# Altium project Key_Project.PrjPcb
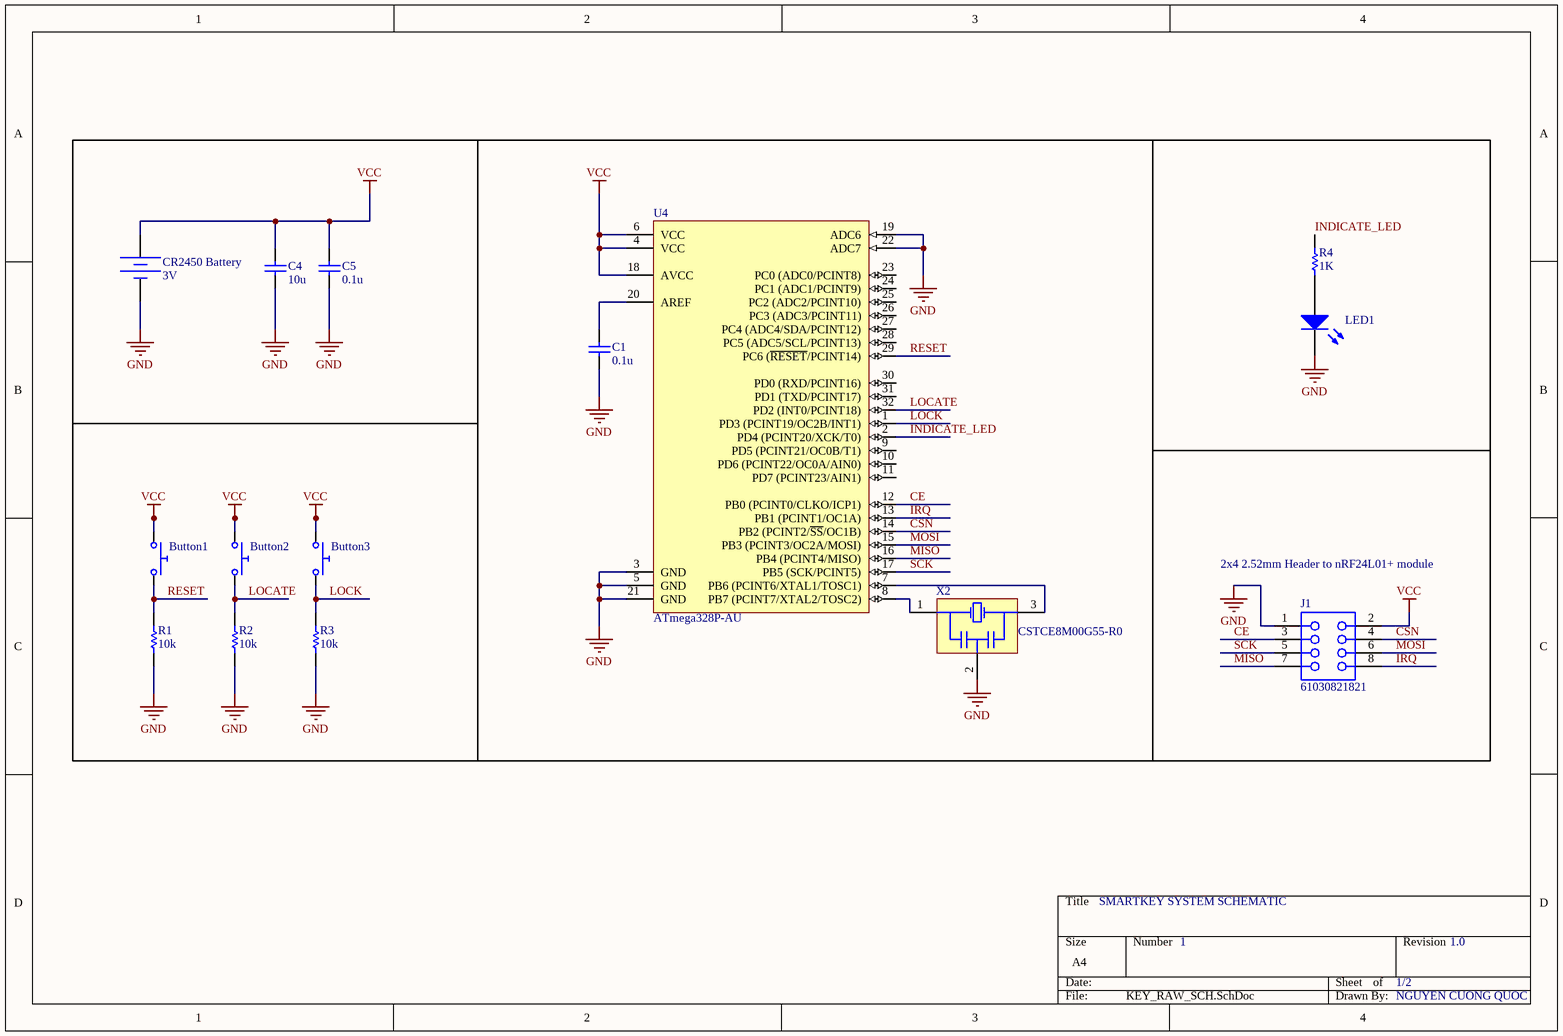
[diagram p0: KEY_RAW_SCH.SchDoc]
3 sheets, 65 parts. Net scope: global (net labels, ports and power ports of the same name join across sheets).
Sheets:
  KEY_RAW_SCH.SchDoc
  VEHICLE_RAW_SCH.SchDoc
  KEY_PCB.SchDoc

## Sheet KEY_RAW_SCH.SchDoc
size A4; SheetNumber: 1; SheetTotal: 3

### Parts
Button1  Push Button Normally Opened  (value not drawn)
Button2  Push Button Normally Opened  (value not drawn)
Button3  Push Button Normally Opened  (value not drawn)
C1  value 0.1u  (hidden comment: Capacitor)
C4  value 10u  (hidden comment: Capacitor)
C5  value 0.1u  (hidden comment: Capacitor)
CR2450_Battery  DC Magnitude: 3V  (hidden comment: Constant Voltage Source)
J1  61030821821  [61030821821]
LED1  Light-Emitting Diode  (value not drawn)
R1  value 10k  (hidden comment: Resistor)
R2  value 10k  (hidden comment: Resistor)
R3  value 10k  (hidden comment: Resistor)
R4  value 1K  (hidden comment: Resistor)
U4  ATmega328P-AU  [32A_M]
X2  CSTCE8M00G55-R0  [MURA-CSTCE_G_A-3_V]

### Nets
GND: C1.1 C4.1 C5.1 CR2450_Battery.2 J1.1 LED1.2(K) R1.1 R2.1 R3.1 U4.3(GND) U4.5(GND) U4.19(ADC6) U4.21(GND) U4.22(ADC7) X2.2(GND)
VCC: Button1.1 Button2.1 Button3.1 C4.2 C5.2 CR2450_Battery.1 J1.2 U4.4(VCC) U4.6(VCC) U4.18(AVCC)
CE: J1.3 U4.12(PB0_(PCINT0/CLKO/ICP1))
CSN: J1.4 U4.14(PB2_(PCINT2/~{SS}/OC1B))
INDICATE_LED: R4.2 U4.2(PD4_(PCINT20/XCK/T0))
IRQ: J1.8 U4.13(PB1_(PCINT1/OC1A))
LOCATE: Button2.2 R2.2 U4.32(PD2_(INT0/PCINT18))
LOCK: Button3.2 R3.2 U4.1(PD3_(PCINT19/OC2B/INT1))
MISO: J1.7 U4.16(PB4_(PCINT4/MISO))
MOSI: J1.6 U4.15(PB3_(PCINT3/OC2A/MOSI))
RESET: Button1.2 R1.2 U4.29(PC6_(~{RESET}/PCINT14))
SCK: J1.5 U4.17(PB5_(SCK/PCINT5))
NetC1_2: C1.2 U4.20(AREF)
NetLED1_1: LED1.1(A) R4.1
NetU4_7: U4.7(PB6_(PCINT6/XTAL1/TOSC1)) X2.3(X2)
NetU4_8: U4.8(PB7_(PCINT7/XTAL2/TOSC2)) X2.1(X1)

Not connected (* = marked no-connect by the designer): U4 9(PD5_(PCINT21/OC0B/T1)) 10(PD6_(PCINT22/OC0A/AIN0)) 11(PD7_(PCINT23/AIN1)) 23(PC0_(ADC0/PCINT8)) 24(PC1_(ADC1/PCINT9)) 25(PC2_(ADC2/PCINT10)) 26(PC3_(ADC3/PCINT11)) 27(PC4_(ADC4/SDA/PCINT12)) 28(PC5_(ADC5/SCL/PCINT13)) 30(PD0_(RXD/PCINT16)) 31(PD1_(TXD/PCINT17))

### Notes on the sheet
- 2x4 2.52mm Header to nRF24L01+ module
- SMARTKEY SYSTEM SCHEMATIC
- 1
- 1/2
- 1.0
- NGUYEN CUONG QUOC

### Library data of the parts
Button1-Button3 = Push Button NO: closed: 0; Rclosed: 1m; Ropen: 1Meg; SimulationGenericComponent: True
C1 C4 C5 = Capacitor: SimulationGenericComponent: True
CR2450_Battery = Battery: SimulationGenericComponent: True
J1 = CMP-1502-01304-3: NexarPartId: 89205501; Gender: Female; Current Rating: 3A; Operating Supply Voltage: 250V; Contact Resistance: 20mΩ; Orientation: Vertical; RoHS: Non-Compliant; Number of Pins: 8; Packaging: Tape and Reel; Lead Pitch: 2.54mm
LED1 = LED: AF: 1; BV: 0; BV_MAX: 1e99; EG: 1.11; FC: 0.5; IBV: 0.001; IS: 1e-14; MJSW: 0.33; NTUN: 30; TNOM: 27; XTI: 3; SimulationGenericComponent: True; CJO: 0; CJP: 0; CTA: 0; CTP: 0; FCS: 0.5; FV_MAX: 1e99; IKF: 0; IKR: 0; ISR: 1e-14; JSW: 0; JTUN: 0; JTUNSW: 0; KEG: 1; KF: 0; LEVEL: 1; N: 1; NBV: 1; NR: 1; NS: 1; PHP: 1; RS: 0; TCV: 0; TLEV: 0; TLEVC: 0; TM1: 0; TM2: 0; TPB: 0; TPHP: 0; TRS: 0; TRS2: 0; TT: 0; TTT1: 0; TTT2: 0; VJ: 1; XTITUN: 3
R1-R4 = Resistor: TC1: 0; SimulationGenericComponent: True; TC2: 0
U4 = CMP-0095-00269-2: 8-bit AVR Microcontroller, 32KB Flash, 1KB EEPROM, 2KB SRAM, 32-pin TQFP, Industrial Grade (-40°C to 85°C); PackageDescription: 32-Lead, 7x7x1.0 mm Body, 0.8mm Lead Pitch, Thin Profile Plastic Quad Flat Package (TQFP); DatasheetVersion: revD, May-2011; RevisionNote: DatasheetVersion & PackageVersion updated. URLs added.; ComponentLink1URL: http://www.atmel.com/; ComponentLink2Description: ATmega48A/48PA/88A/88PA/168A/168PA/328/328P Datasheet; Code_JEDEC: MS-026-ABA; ComponentLink1Description: Manufacturer URL; PackageReference: 32A; ComponentLink3Description: ATmega48A/48PA/88A/88PA/168A/168PA/328/328P Summary; ComponentLink2URL: http://www.atmel.com/dyn/resources/prod_documents/doc8271.pdf; PackageVersion: revC, Oct-2010; ComponentLink3URL: http://www.atmel.com/dyn/resources/prod_documents/8271S.pdf
X2 = CMP-2100-03620-1: Ceramic Resonator, 8 MHz, +/- 0.5%, -20 to 80 degC, 3-Pin SMD, RoHS, Tape and Reel; Manufacturer: Murata; Capacitance: 33pF; Frequency Stability: 0.2%; Self Resonant Frequency: 8MHz; Datasheet Version: 42339.0; RoHSCompliant: True; Datasheet URL: http://www.murata.com/~/media/webrenewal/support/library/catalog/products/timingdevice/ceralock/p16e.ashx; Case/Package: Ceramic; Load Capacitance: 33pF; Tolerance: 0.5%; Mount: SurfaceMount; Height: 0.031inch; Number of Pins: 3; Package Description: 3-Pin Surface Mount Device, Body 3.2 x 1.3 mm, Pitch 1.2 mm; Package Quantity: 1; Lead Free: LeadFree; Contact Plating: Gold; REACH SVHC: NoSVHC; Length: 0.126inch; Width: 0.051inch; Manufacturer URL: http://www.murata.com/; Packaging: TapeandReel; Termination: SMD/SMT; Frequency Tolerance: 0.5%; Max Operating Temperature: 80degC; Composition: Ceramic; Package Reference: CSTCE_G_A-3; Min Operating Temperature: -20degC; Frequency: 8MHz

## Sheet VEHICLE_RAW_SCH.SchDoc
size A4; SheetNumber: 2; SheetTotal: 3
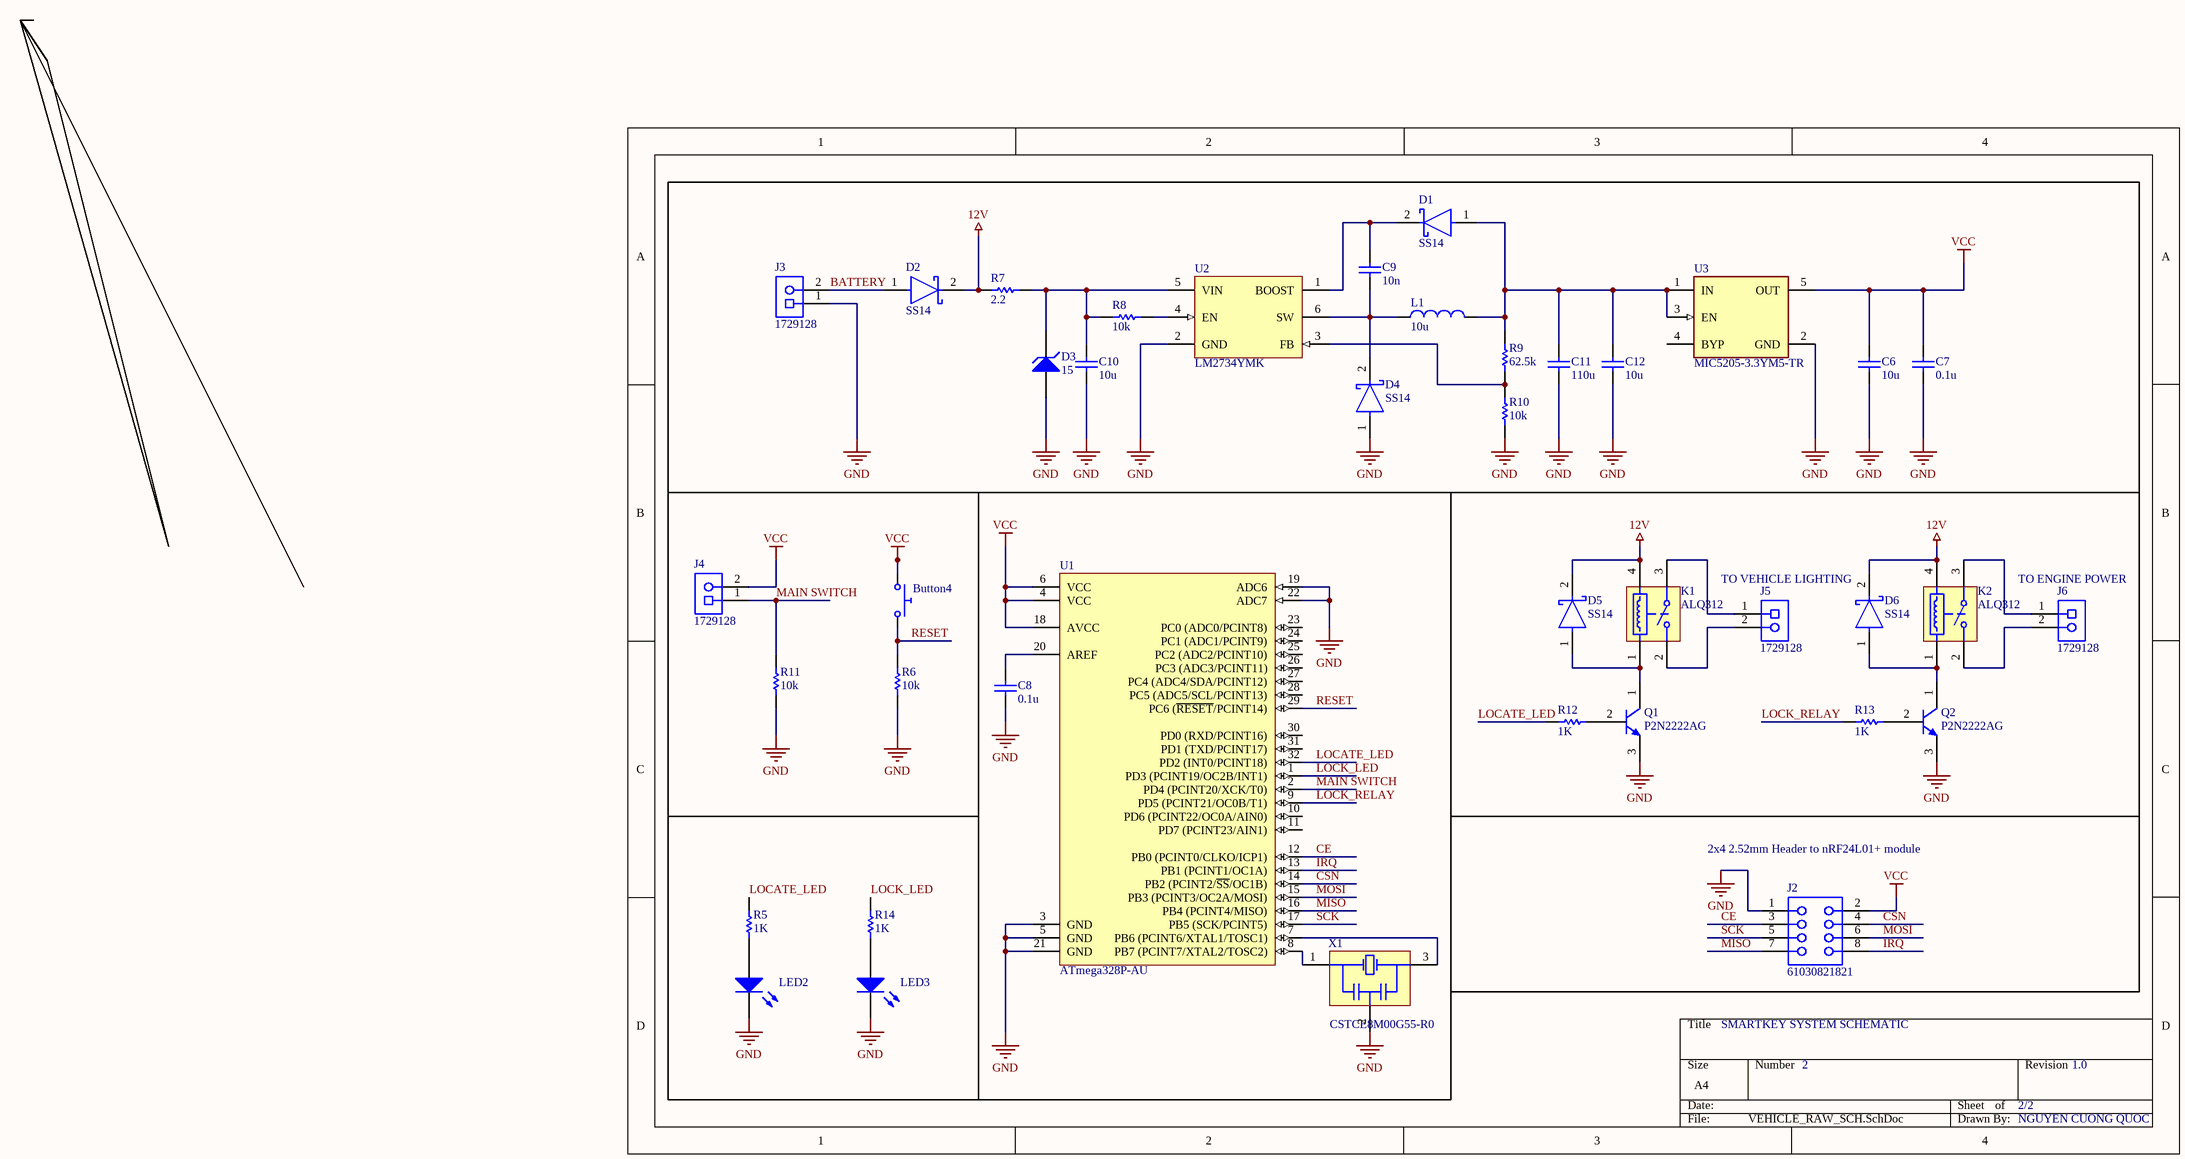
[diagram p1: VEHICLE_RAW_SCH.SchDoc]

### Parts
Button4  Push Button Normally Opened  (value not drawn)
C6  value 10u  (hidden comment: Capacitor)
C7  value 0.1u  (hidden comment: Capacitor)
C8  value 0.1u  (hidden comment: Capacitor)
C9  value 10n  (hidden comment: Capacitor)
C10  value 10u  (hidden comment: Capacitor)
C11  value 110u  (hidden comment: Capacitor)
C12  value 10u  (hidden comment: Capacitor)
D1  SS14  [FP-403AE-MFG]
D2  SS14  [FP-403AE-MFG]
D3  BV: 15  (hidden comment: Zener Diode)
D4  SS14  [FP-403AE-MFG]
D5  SS14  [FP-403AE-MFG]
D6  SS14  [FP-403AE-MFG]
J2  61030821821  [61030821821]
J3  1729128  [PHOE-1729128-2_V]
J4  1729128  [PHOE-1729128-2_V]
J5  1729128  [PHOE-1729128-2_V]
J6  1729128  [PHOE-1729128-2_V]
K1  ALQ312  [PNSC-LQ-4-2000x1000x1600_V]
K2  ALQ312  [PNSC-LQ-4-2000x1000x1600_V]
L1  value 10u  (hidden comment: Inductor)
LED2  Light-Emitting Diode  (value not drawn)
LED3  Light-Emitting Diode  (value not drawn)
Q1  P2N2222AG  [ONSC-TO-92-3-29-11]
Q2  P2N2222AG  [ONSC-TO-92-3-29-11]
R5  value 1K  (hidden comment: Resistor)
R6  value 10k  (hidden comment: Resistor)
R7  value 2.2  (hidden comment: Resistor)
R8  value 10k  (hidden comment: Resistor)
R9  value 62.5k  (hidden comment: Resistor)
R10  value 10k  (hidden comment: Resistor)
R11  value 10k  (hidden comment: Resistor)
R12  value 1K  (hidden comment: Resistor)
R13  value 1K  (hidden comment: Resistor)
R14  value 1K  (hidden comment: Resistor)
U1  ATmega328P-AU  [32A_M]
U2  LM2734YMK  [DDC0006A_M]
U3  MIC5205-3.3YM5-TR  [FP-M5-MFG]
X1  CSTCE8M00G55-R0  [MURA-CSTCE_G_A-3_V]

### Nets
12V: D2.2(C) D5.2(C) D6.2(C) K1.4 K2.4 R7.2
GND: C6.1 C7.1 C8.1 C10.1 C11.1 C12.1 D3.1(A) D4.1(A) J2.1 J3.1 LED2.2(K) LED3.2(K) Q1.3(E) Q2.3(E) R6.1 R10.2 R11.1 U1.3(GND) U1.5(GND) U1.19(ADC6) U1.21(GND) U1.22(ADC7) U2.2(GND) U3.2(GND) X1.2(GND)
VCC: Button4.1 C6.2 C7.2 J2.2 J4.2 U1.4(VCC) U1.6(VCC) U1.18(AVCC) U3.5(OUT)
BATTERY: D2.1(A) J3.2
CE: J2.3 U1.12(PB0_(PCINT0/CLKO/ICP1))
CSN: J2.4 U1.14(PB2_(PCINT2/~{SS}/OC1B))
IRQ: J2.8 U1.13(PB1_(PCINT1/OC1A))
LOCATE_LED: R5.2 R12.2 U1.32(PD2_(INT0/PCINT18))
LOCK_LED: R14.2 U1.1(PD3_(PCINT19/OC2B/INT1))
LOCK_RELAY: R13.2 U1.9(PD5_(PCINT21/OC0B/T1))
MAIN SWITCH: J4.1 R11.2 U1.2(PD4_(PCINT20/XCK/T0))
MISO: J2.7 U1.16(PB4_(PCINT4/MISO))
MOSI: J2.6 U1.15(PB3_(PCINT3/OC2A/MOSI))
RESET: Button4.2 R6.2 U1.29(PC6_(~{RESET}/PCINT14))
SCK: J2.5 U1.17(PB5_(SCK/PCINT5))
NetC8_2: C8.2 U1.20(AREF)
NetC9_1: C9.1 D4.2(C) L1.1 U2.6(SW)
NetC9_2: C9.2 D1.2(C) U2.1(BOOST)
NetC10_2: C10.2 D3.2(K) R7.1 R8.2 U2.5(VIN)
NetC11_2: C11.2 C12.2 D1.1(A) L1.2 R9.1 U3.1(IN) U3.3(EN)
NetD5_1: D5.1(A) K1.1 Q1.1(C)
NetD6_1: D6.1(A) K2.1 Q2.1(C)
NetJ5_1: J5.1 K1.3(COM)
NetJ5_2: J5.2 K1.2(NO)
NetJ6_1: J6.1 K2.3(COM)
NetJ6_2: J6.2 K2.2(NO)
NetLED2_1: LED2.1(A) R5.1
NetLED3_1: LED3.1(A) R14.1
NetQ1_2: Q1.2(B) R12.1
NetQ2_2: Q2.2(B) R13.1
NetR8_1: R8.1 U2.4(EN)
NetR9_2: R9.2 R10.1 U2.3(FB)
NetU1_7: U1.7(PB6_(PCINT6/XTAL1/TOSC1)) X1.3(X2)
NetU1_8: U1.8(PB7_(PCINT7/XTAL2/TOSC2)) X1.1(X1)

Not connected (* = marked no-connect by the designer): U1 10(PD6_(PCINT22/OC0A/AIN0)) 11(PD7_(PCINT23/AIN1)) 23(PC0_(ADC0/PCINT8)) 24(PC1_(ADC1/PCINT9)) 25(PC2_(ADC2/PCINT10)) 26(PC3_(ADC3/PCINT11)) 27(PC4_(ADC4/SDA/PCINT12)) 28(PC5_(ADC5/SCL/PCINT13)) 30(PD0_(RXD/PCINT16)) 31(PD1_(TXD/PCINT17)); U3 4(BYP)

### Notes on the sheet
- TO VEHICLE LIGHTING
- (near J6) TO ENGINE POWER
- 2x4 2.52mm Header to nRF24L01+ module
- SMARTKEY SYSTEM SCHEMATIC
- 2
- 2/2
- 1.0
- NGUYEN CUONG QUOC

### Library data of the parts
Button4 = Push Button NO: as Button1 on sheet KEY_RAW_SCH
C6-C12 = Capacitor: SimulationGenericComponent: True
D1 D2 D4-D6 = CMP-2000-04943-2: DIODE SCHOTTKY 40V 1A SMA; Manufacturer: ON Semiconductor; Peak Reverse Current: 0.2mA; Max Junction Temp: +125°C; Standoff Height: 0.05mm; Max Surge Forward Current: 40A; Mouser Description: Schottky Diodes & Rectifiers SMA 40V 1.0A; RoHS: TRUE; Lead Free: Yes; Manufacturer Part Number: SS14; Device Class L3: Schottky Diodes; Category: Diode; Automotive: No; Digikey Description: DIODE SCHOTTKY 40V 1A SMA; ComponentLink2Description: Datasheet; Device Class L2: Diodes; Height: 2.5mm; Temperature Range High: +125°C; ComponentLink2URL: https://www.onsemi.com/pub/Collateral/SS19-D.PDF; Device Class L1: Discrete Semiconductors; Package: 403AE; Octopart: https://octopart.com/ss14-on+semiconductor-29205033; Max Repetitive Reverse Voltage: 40V; Temperature Range Low: -65°C; Forward Current: 1A; Temperature: -65°C to +125°C
D3 = Zener Diode: AF: 1; BV_MAX: 1e99; CJO: 0; EG: 1.11; FC: 0.5; IBV: 0.001; IS: 1e-14; MJSW: 0.33; NTUN: 30; TNOM: 27; XTI: 3; SimulationGenericComponent: True; CJP: 0; CTA: 0; CTP: 0; FCS: 0.5; FV_MAX: 1e99; IKF: 0; IKR: 0; ISR: 1e-14; JSW: 0; JTUN: 0; JTUNSW: 0; KEG: 1; KF: 0; LEVEL: 1; N: 1; NBV: 1; NR: 1; NS: 1; PHP: 1; RS: 0; TCV: 0; TLEV: 0; TLEVC: 0; TM1: 0; TM2: 0; TPB: 0; TPHP: 0; TRS: 0; TRS2: 0; TT: 0; TTT1: 0; TTT2: 0; VJ: 1; XTITUN: 3
J2 = CMP-1502-01304-3: as J1 on sheet KEY_RAW_SCH; Orientation: Vertical; RoHS: Non-Compliant; Number of Pins: 8; Packaging: Tape and Reel; Lead Pitch: 2.54mm
J3-J6 = CMP-2000-05815-1: PCB Terminal Block, 13.5 A, 400 V, 2-Pin THD, RoHS, Bulk; Manufacturer: Phoenix Contact; Package Version: 03/2015; No. of Rows: 1; Pitch: 5.08mm; No. of Positions: 2; Voltage Rating: 400V; Current Rating: 13500mA; Manufacturer URL: http://www.phoenixcontact.com/; Datasheet URL: https://datasheet.ciiva.com/16046/1729128-16046181.pdf; RoHS: TRUE; Package URL: https://www.phoenixcontact.com/online/portal/pi/pxc/product_detail_page/!ut/p/b1/3VdJjqNKFDxLH8AFycySyWY2ozFsEPOMMQaDOX1XedGL_1Vdm5YXJleknhSKeBkvI6EA8ncAo3AYoDhBQGco6KN7VURTdemj9us_IEKEZo_YHiPAEWEFmDGOHMORkqKYCORBZxgL7ZoaZYcbFFUZ3fqxSY6GOuxydWUuHqz1ynmMFygu583Bob0Ewr6Sd_l-5m-kAueHiB0jpRwZwe58wwtkpxtMYd_LmGcDRU02dRNEyWt6Y2ti5pSyJ_reIkzIulrqApdnbT11V5jnCKbYNCvhEM1MCpPByat_X379-iThf08CI5GfOPqfBeS3BRoBOdD55AKVv0iLwCMq-2BrzXWSGRH7pUGD9uwXQjiph3xL0DKQwdGa0JImiIOmBNOestqgwTHSSs2oOep-78apyXQBvNi8ZLaFjvjWvcaUEBu0MC6Wbe-d6mB0FAebo2lUWinqYaZs5DAYzV0RP9yitUjnGJ0iI9xhZkT42OCQNUJJhkgWINNQLP2JFP6OpMg3JCVg70jqHT0lvKOnhHf0lPuOnnLf0VPuWx6_dxwUIvwk5WMkT0kLL1mh61l2yZVSzG3pYV_bqo-mj6uMKwKwdnnW8Jh5RTOJzMOA5c-eJDaZQw4mTMPH02PvS_ZAqNVjVTo2WyYLkwH_KU1mmmG5kjRhDqPXLwwVHvVOjCM60-fpXvTDfMGW1PVFVS1r4e4yVDk4ZdNbkUHvqPqQSeian4UD39fNKmachqdJ1NJbyk8rXT9mXTvPk3oE5meulKGgiruPJek-4I9hTT6G8ZLOyRSm2RRVbThERQad5OS28hdt4YW4vG0stgYYzsWsK4_7y6DZMjJSCqri1kyiZR5vD7pwIrNR7QwPHTcLTI5qT7eRlpHrdGiupYlqQDJ7zy_CND8fWWBoLRXxk1RVcXiBQwbTD4Xi7KL-FuO94t9xaqweXzH; PartNumber: 1729128; Package Description: 2-Pin Through Hole Device, Body 8.1 x 10.16 mm, Pitch 5.08 mm; Datasheet Version: 12/2013; Mounting Technology: ThroughHole; Orientation: Horizontal; Package Reference: 1729128-2; Packing: Bulk
K1 K2 = CMP-1503-00190-1: LQ Relays, 12 V Coil Voltage, 200 mW Nominal Operating Power, -40 to 85 degC, 4-Pin LQ, Carton, Case, RoHS; Manufacturer: Panasonic; Pb-Free: True; Nominal Operating Power: 200 mW; Max Switching Current: 10 A (N.O.), 3 A (N.C.); Electrical Life: 5x10^4; Coil Voltage: 12 V; Mechanical Life(Min.operation): 1x10^7; Max Switching Voltage: 250 V AC; Mounting Technology: Through Hole; ComponentLink3URL: http://www3.panasonic.biz/ac/e_download/control/relay/power/catalog/mech_eng_lq.pdf?f_cd=401220; Series: LQ Relays; Packing: Carton, Case; RoHS: True; PackageVersion: ASCTB92E, 10/2014; ComponentLink1URL: http://www3.panasonic.biz/ac/ae/index.jsp; PartNumber: ALQ312; PackageReference: LQ-4-2000x1000x1600; PackageDescription: 4-Pin Through Hole Terminal Package, Body 20 x 10 mm; ComponentLink2URL: http://www3.panasonic.biz/ac/e_download/control/relay/power/catalog/mech_eng_lq.pdf?f_cd=401220; ComponentLink3Description: Package Specification; ComponentLink2Description: Datasheet; ComponentLink1Description: Manufacturer URL; DatasheetVersion: 201410-T
L1 = Inductor: SimulationGenericComponent: True
LED2 LED3 = LED: as LED1 on sheet KEY_RAW_SCH; CJO: 0; CJP: 0; CTA: 0; CTP: 0; FCS: 0.5; FV_MAX: 1e99; IKF: 0; IKR: 0; ISR: 1e-14; JSW: 0; JTUN: 0; JTUNSW: 0; KEG: 1; KF: 0; LEVEL: 1; N: 1; NBV: 1; NR: 1; NS: 1; PHP: 1; RS: 0; TCV: 0; TLEV: 0; TLEVC: 0; TM1: 0; TM2: 0; TPB: 0; TPHP: 0; TRS: 0; TRS2: 0; TT: 0; TTT1: 0; TTT2: 0; VJ: 1; XTITUN: 3
Q1 Q2 = CMP-1048-01402-1: Amplifier Transistor, NPN Silicon, 3-Pin TO-92, Pb-Free, Bulk Box; Manufacturer: On Semiconductor; IC Continuous (A): 0.6; fT Min (MHz): 300; ComponentLink2Description: Datasheet; ComponentLink1Description: Manufacturer URL; ComponentLink2URL: http://www.onsemi.com/pub_link/Collateral/P2N2222A-D.PDF; ComponentLink3Description: Package Specification; RoHS: TRUE; ComponentLink1URL: http://www.onsemi.com/; PartNumber: P2N2222AG; Mounting Technology: Through Hole; PackageReference: TO-92-3-29-11_AM_SL; Polarity: NPN; Packing: Bulk Box; DatasheetVersion: Rev. 7; PackageDescription: 3-Pin Transistor Outline, Body 4.825 x 3.685 mm, Pitch 1.27 mm; PackageVersion: Rev. AM; ComponentLink3URL: http://www.onsemi.cn/pub_link/Collateral/2N6426-D.PDF
R5-R14 = Resistor: TC1: 0; SimulationGenericComponent: True; TC2: 0
U1 = CMP-0095-00269-2: as U4 on sheet KEY_RAW_SCH; PackageDescription: 32-Lead, 7x7x1.0 mm Body, 0.8mm Lead Pitch, Thin Profile Plastic Quad Flat Package (TQFP); DatasheetVersion: revD, May-2011; RevisionNote: DatasheetVersion & PackageVersion updated. URLs added.; ComponentLink1URL: http://www.atmel.com/; ComponentLink2Description: ATmega48A/48PA/88A/88PA/168A/168PA/328/328P Datasheet; Code_JEDEC: MS-026-ABA; ComponentLink1Description: Manufacturer URL; PackageReference: 32A; ComponentLink3Description: ATmega48A/48PA/88A/88PA/168A/168PA/328/328P Summary; ComponentLink2URL: http://www.atmel.com/dyn/resources/prod_documents/doc8271.pdf; PackageVersion: revC, Oct-2010; ComponentLink3URL: http://www.atmel.com/dyn/resources/prod_documents/8271S.pdf
U2 = CMP-0069-01204-3: 1A Load Step-Down DC-DC Regulator, 6-pin Tiny SOT23; Manufacturer: Texas Instruments; PackageTopMarking: SFEB*XTT; PowerWise: N; CompType: Switcher; PinCount: 6; Code_JEDEC: MO-193-AA; PackageDescription: Molded TSOT, 2.97 x 1.65 x 0.87mm Body, 6 Lead, 0.95mm Pitch; PackageReference: DDC0006A; Code_IPC: SOT26A-6; RoHS: N; ComponentLink1URL: http://www.ti.com/general/docs/lit/getliterature.tsp?genericPartNumber=LM2734&fileType=pdf; ComponentLink1Description: Datasheet URL
U3 = CMP-06324-000014-1: IC REG LINEAR 3.3V 150MA SOT23-5; Manufacturer: Microchip; Number Of Outputs: 1; Output Type: Fixed; Min Supply Voltage: 2.5V; Accuracy Percentage: 2%; Dropout Voltage: 165mV; Max Supply Voltage: 16V; Max Junction Temp: +125°C; Standoff Height: 0mm; Digikey Description: IC REG LINEAR 3.3V 150MA SOT23-5; Output Current: 150mA; Temperature: -40°C to +125°C; Temperature Range High: +125°C; Height: 1.45mm; ComponentLink2URL: http://ww1.microchip.com/downloads/en/DeviceDoc/20005785A.pdf; Mouser Description: LDO Voltage Regulators; Device Class L3: Voltage Regulators - Linear; Package: M5; Temperature Range Low: -40°C; Device Class L1: Integrated Circuits (ICs); ComponentLink2Description: Datasheet; Automotive: No; Ipc Land Pattern Name: SOT95P280X118-5; Octopart: https://octopart.com/mic5205-3.3ym5-tr-microchip-66802130; Device Class L2: Power Management ICs; Manufacturer Part Number: MIC5205-3.3YM5-TR; Lead Free: Yes; RoHS: TRUE
X1 = CMP-2100-03620-1: as X2 on sheet KEY_RAW_SCH; Datasheet Version: 42339.0; RoHSCompliant: True; Datasheet URL: http://www.murata.com/~/media/webrenewal/support/library/catalog/products/timingdevice/ceralock/p16e.ashx; Case/Package: Ceramic; Load Capacitance: 33pF; Tolerance: 0.5%; Mount: SurfaceMount; Height: 0.031inch; Number of Pins: 3; Package Description: 3-Pin Surface Mount Device, Body 3.2 x 1.3 mm, Pitch 1.2 mm; Package Quantity: 1; Lead Free: LeadFree; Contact Plating: Gold; REACH SVHC: NoSVHC; Length: 0.126inch; Width: 0.051inch; Manufacturer URL: http://www.murata.com/; Packaging: TapeandReel; Termination: SMD/SMT; Frequency Tolerance: 0.5%; Max Operating Temperature: 80degC; Composition: Ceramic; Package Reference: CSTCE_G_A-3; Min Operating Temperature: -20degC; Frequency: 8MHz

## Sheet KEY_PCB.SchDoc
size A4; SheetNumber: 3; SheetTotal: 3
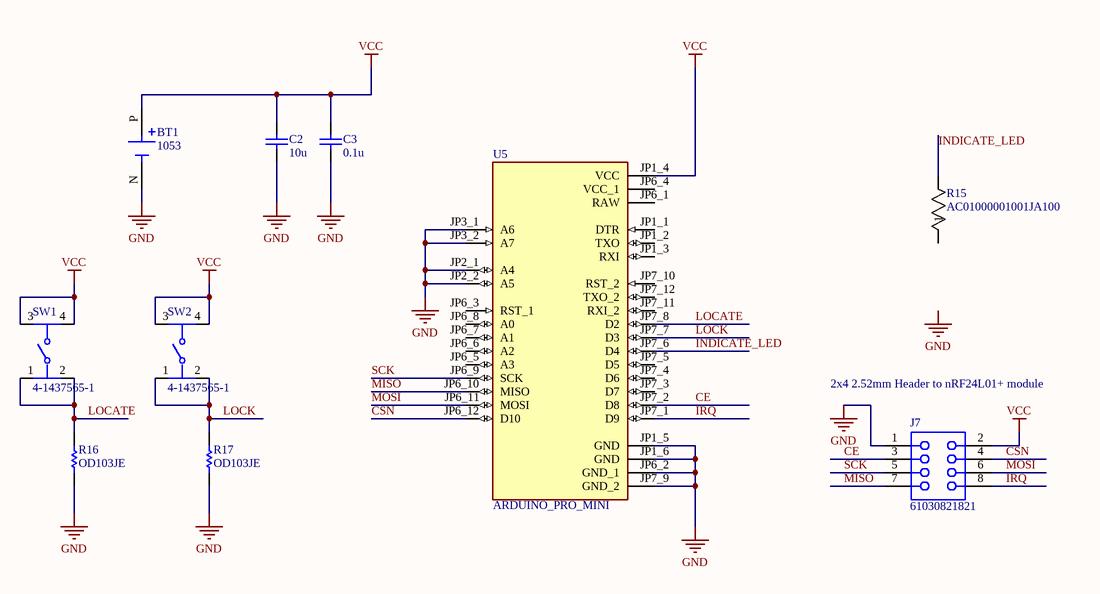
[diagram p2: KEY_PCB.SchDoc]

### Parts
BT1  1053  [BAT_1053]
C2  value 10u  (hidden comment: Capacitor)
C3  value 0.1u  (hidden comment: Capacitor)
J7  61030821821  [61030821821]
R15  AC01000001001JA100  [RES_AC01_VIS]
R16  OD103JE  [OMTE-RES7X2.5-2]
R17  OD103JE  [OMTE-RES7X2.5-2]
SW1  4-1437565-1  [FP-4-1437565-1-MFG]
SW2  4-1437565-1  [FP-4-1437565-1-MFG]
U5  ARDUINO_PRO_MINI  [MODULE_ARDUINO_PRO_MINI]

### Nets
GND: BT1.N(NEG) C2.1 C3.1 J7.1 R16.1 R17.1 U5.JP1_5(GND) U5.JP1_6(GND) U5.JP2_1(A4) U5.JP2_2(A5) U5.JP3_1(A6) U5.JP3_2(A7) U5.JP6_2(GND_1) U5.JP7_9(GND_2)
VCC: BT1.P(POS) C2.2 C3.2 J7.2 SW1.3 SW1.4 SW2.3 SW2.4 U5.JP1_4(VCC)
CE: J7.3 U5.JP7_2(D8)
CSN: J7.4 U5.JP6_12(D10)
INDICATE_LED: R15.2 U5.JP7_6(D4)
IRQ: J7.8 U5.JP7_1(D9)
LOCATE: R16.2 SW1.1 SW1.2 U5.JP7_8(D2)
LOCK: R17.2 SW2.1 SW2.2 U5.JP7_7(D3)
MISO: J7.7 U5.JP6_10(MISO)
MOSI: J7.6 U5.JP6_11(MOSI)
SCK: J7.5 U5.JP6_9(SCK)

Not connected (* = marked no-connect by the designer): R15 1; U5 JP1_1(DTR) JP1_2(TXO) JP1_3(RXI) JP6_1(RAW) JP6_3(RST_1) JP6_4(VCC_1) JP6_5(A3) JP6_6(A2) JP6_7(A1) JP6_8(A0) JP7_3(D7) JP7_4(D6) JP7_5(D5) JP7_10(RST_2) JP7_11(RXI_2) JP7_12(TXO_2)

### Notes on the sheet
- 2x4 2.52mm Header to nRF24L01+ module
- Labels drawn without touching a wire or pin: GND

### Library data of the parts
BT1 = 1053: Battery Holder, Auto-In/EZ-Out, THM, Coin Cell, 24mm, Plastic, UL94V-0, Black | Keystone Electronics 1053; SnapEDA_Link: https://www.snapeda.com/parts/1053/Keystone/view-part/?ref=snap; Package: Package; Value: *; MF: Keystone Electronics; MP: 1053; Check_prices: https://www.snapeda.com/parts/1053/Keystone/view-part/?ref=eda
C2 C3 = Capacitor: SimulationGenericComponent: True
J7 = CMP-1502-01304-3: as J1 on sheet KEY_RAW_SCH; Orientation: Vertical; RoHS: Non-Compliant; Number of Pins: 8; Packaging: Tape and Reel; Lead Pitch: 2.54mm
R15 = CMP-T1-00030-42521882-4: VISHAY AC01000001001JA100 Through Hole Resistor, 1 kohm, Axial Leaded, 1 W, 5%, AC Series; Lead Diameter: 800µm; Power Rating: 1W; Temperature Coefficient: 180ppm/°C; Voltage Rating (DC): 32V; Resistance: 1kΩ; Lead Free: Lead Free; Features: Flame Retardant Coating; RoHS: Compliant; Radiation Hardening: No; Packaging: Tape & Box (TB); Length: 11mm; Min Operating Temperature: -40°C; Military Standard: Not; Case/Package: Axial; Number of Pins: 2; Diameter: 4.3mm; Tolerance: 5%; Contact Plating: Tin; NexarPartId: 42521882; Number of Terminations: 2; REACH SVHC: Unknown; Termination: Axial; Composition: Wirewound; Max Power Dissipation: 1W; Max Operating Temperature: 275°C; Schedule B: 8533210080, 8533210080
R16 R17 = CMP-2000-06865-1: Little Demon(R) Carbon Composition Molded OD Series, 250 V, 10 KOhm, +/-5%, -70 to 130 degC, 2-Pin THD, RoHS, Bulk; Manufacturer: Ohmite; Resistance (Ohms): 10k; Power Rating: 0.25W; Power (Watts): 0.25W,1/4W; Tolerance: ±5%; Online Catalog: OD,OF,OASeries,LittleDemon®; Catalog Drawings: OD,OF,OASeries; EDA / CAD Models: DownloadfromAcceleratedDesigns; Mounting Technology: ThroughHole; Datasheet Version: 06/2016; RoHS Information: LittleDemon"E"SeriesMaterialDeclaration; Number of Terminations: 2; Temperature Coefficient: -; Height: -; Composition: CarbonComposition; Package Description: 2-Pin THD Resistor, Body 7 x 2.5 mm, Lead Dia. 0.6 mm; Size / Dimension: 0.098"Diax0.276"L(2.50mmx7.00mm); Category: Resistors; Manufacturer URL: http://www.ohmite.com/; Features: PulseWithstanding; Family: ThroughHoleResistors; PartNumber: OD103JE; Supplier Device Package: Axial; Package / Case: Axial; Standard Package: 100; Package Reference: RES7X2.5; Operating Temperature: -; Series: LittleDemon®OD; Datasheet URL: http://www.ohmite.com/cat/res_od_of_oa.pdf; Packaging: Bulk
SW1 SW2 = CMP-03407-000003-1: SWITCH TACTILE SPST-NO 0.05A 24V; Manufacturer: TE Connectivity; Ciiva Ids: 2672442; Contact Current Rating: 50mA; Operating Force: 160gf; Contact Resistance: 100mΩ; Electromechanical Life: 100000Cycles; Standoff Height: 0.05mm; Import Ts: 1521848451; Category: Switch; ComponentLink2Description: Datasheet; Mount: Surface Mount; Digikey Description: SWITCH TACTILE SPST-NO 0.05A 24V; Device Class L3: Tactile Switches; Release Date: 1503379960; Octopart: https://octopart.com/fsm4jsma-te+connectivity-55488004; Temperature Range Low: -35°C; Lead Free: Yes; RoHS: TRUE; Mouser Description: Switch Tactile OFF (ON) SPST Round Button Gull Wing 0.05A 12VDC 1.57N SMD Loose Piece; Voltage Rating Dc: 24V; ComponentLink2URL: https://www.te.com/commerce/DocumentDelivery/DDEController?Action=showdoc&DocId=Customer+Drawing%7F2-1437565-7%7FV%7Fpdf%7FEnglish%7FENG_CD_2-1437565-7_V.pdf%7F4-1437565-1; Height: 5.38mm; Package: 0; Temperature Range High: +85°C; Device Class L2: Switches; Manufacturer Part Number: 4-1437565-1; Temperature: -35°C to +85°C; Device Class L1: Electromechanical; Automotive: No; Throw Configuration: SPST-NO
U5 = ARDUINO_PRO_MINI: This board was developed for applications and installations where space is premium and projects are made as permanent set ups. Small, available in 3.3 V and 5 V versions, powered by ATmega328P.; MP: Arduino Pro Mini; SnapEDA_Link: https://www.snapeda.com/parts/Arduino%20Pro%20Mini/Arduino/view-part/?ref=snap; Package: None; Value: *; MF: Arduino; Check_prices: https://www.snapeda.com/parts/Arduino%20Pro%20Mini/Arduino/view-part/?ref=eda

## Nets that join several sheets
GND: KEY_RAW_SCH (15 pins), VEHICLE_RAW_SCH (25 pins), KEY_PCB (14 pins)
VCC: KEY_RAW_SCH (10 pins), VEHICLE_RAW_SCH (9 pins), KEY_PCB (9 pins)
CE: KEY_RAW_SCH (J1.3 U4.12), VEHICLE_RAW_SCH (J2.3 U1.12), KEY_PCB (J7.3 U5.JP7_2)
CSN: KEY_RAW_SCH (J1.4 U4.14), VEHICLE_RAW_SCH (J2.4 U1.14), KEY_PCB (J7.4 U5.JP6_12)
INDICATE_LED: KEY_RAW_SCH (R4.2 U4.2), KEY_PCB (R15.2 U5.JP7_6)
IRQ: KEY_RAW_SCH (J1.8 U4.13), VEHICLE_RAW_SCH (J2.8 U1.13), KEY_PCB (J7.8 U5.JP7_1)
LOCATE: KEY_RAW_SCH (Button2.2 R2.2 U4.32), KEY_PCB (R16.2 SW1.1 SW1.2 U5.JP7_8)
LOCK: KEY_RAW_SCH (Button3.2 R3.2 U4.1), KEY_PCB (R17.2 SW2.1 SW2.2 U5.JP7_7)
MISO: KEY_RAW_SCH (J1.7 U4.16), VEHICLE_RAW_SCH (J2.7 U1.16), KEY_PCB (J7.7 U5.JP6_10)
MOSI: KEY_RAW_SCH (J1.6 U4.15), VEHICLE_RAW_SCH (J2.6 U1.15), KEY_PCB (J7.6 U5.JP6_11)
RESET: KEY_RAW_SCH (Button1.2 R1.2 U4.29), VEHICLE_RAW_SCH (Button4.2 R6.2 U1.29)
SCK: KEY_RAW_SCH (J1.5 U4.17), VEHICLE_RAW_SCH (J2.5 U1.17), KEY_PCB (J7.5 U5.JP6_9)